# Vivado block design block_design, Vivado 2015.3
# (continued, part 2 of 3)
current_bd_instance /hier_ps
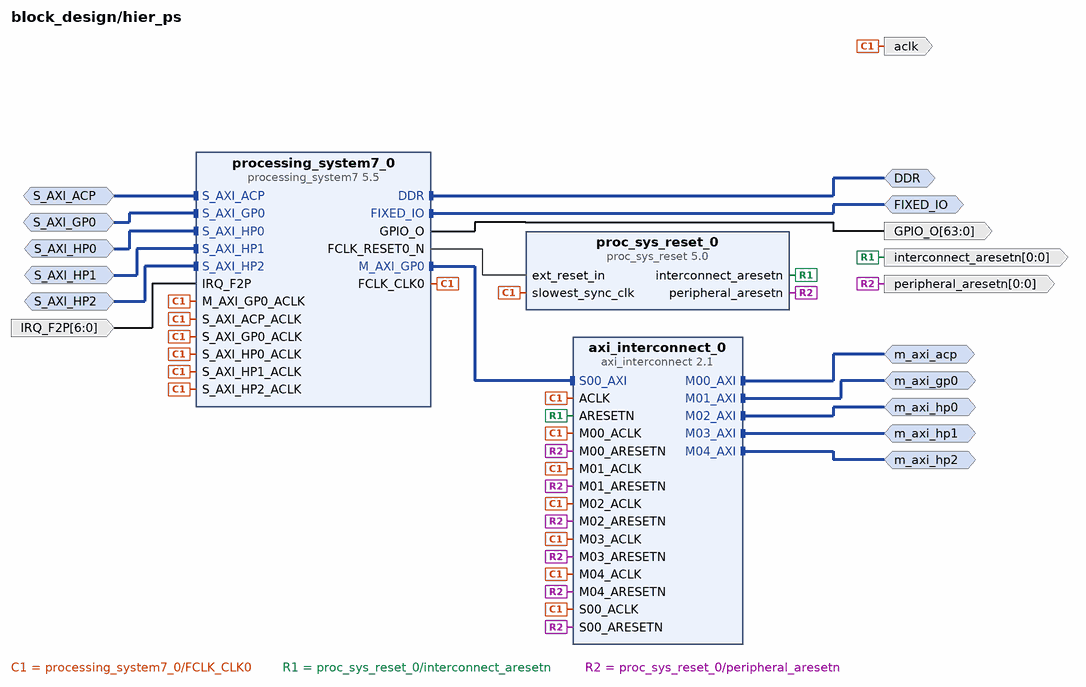
[diagram p24: block diagram inside /hier_ps]
create_bd_intf_pin -mode Master -vlnv xilinx.com:interface:ddrx_rtl:1.0 DDR
create_bd_intf_pin -mode Master -vlnv xilinx.com:display_processing_system7:fixedio_rtl:1.0 FIXED_IO
create_bd_intf_pin -mode Slave -vlnv xilinx.com:interface:aximm_rtl:1.0 S_AXI_ACP
create_bd_intf_pin -mode Slave -vlnv xilinx.com:interface:aximm_rtl:1.0 S_AXI_GP0
create_bd_intf_pin -mode Slave -vlnv xilinx.com:interface:aximm_rtl:1.0 S_AXI_HP0
create_bd_intf_pin -mode Slave -vlnv xilinx.com:interface:aximm_rtl:1.0 S_AXI_HP1
create_bd_intf_pin -mode Slave -vlnv xilinx.com:interface:aximm_rtl:1.0 S_AXI_HP2
create_bd_intf_pin -mode Master -vlnv xilinx.com:interface:aximm_rtl:1.0 m_axi_acp
create_bd_intf_pin -mode Master -vlnv xilinx.com:interface:aximm_rtl:1.0 m_axi_gp0
create_bd_intf_pin -mode Master -vlnv xilinx.com:interface:aximm_rtl:1.0 m_axi_hp0
create_bd_intf_pin -mode Master -vlnv xilinx.com:interface:aximm_rtl:1.0 m_axi_hp1
create_bd_intf_pin -mode Master -vlnv xilinx.com:interface:aximm_rtl:1.0 m_axi_hp2
create_bd_pin -dir O -from 63 -to 0 GPIO_O
create_bd_pin -dir I -from 6 -to 0 -type intr IRQ_F2P
create_bd_pin -dir O aclk
create_bd_pin -dir O -from 0 -to 0 peripheral_aresetn
create_bd_pin -dir O -from 0 -to 0 interconnect_aresetn

create_bd_cell -type ip -vlnv xilinx.com:ip:axi_interconnect:2.1 axi_interconnect_0
set_property -dict {CONFIG.NUM_MI 5 CONFIG.STRATEGY 2} [get_bd_cells axi_interconnect_0]
create_bd_cell -type ip -vlnv xilinx.com:ip:proc_sys_reset:5.0 proc_sys_reset_0
create_bd_cell -type ip -vlnv xilinx.com:ip:processing_system7:5.5 processing_system7_0
set_property -dict [list \
  CONFIG.PCW_USE_S_AXI_GP0 1 \
  CONFIG.PCW_USE_S_AXI_ACP 1 \
  CONFIG.PCW_USE_S_AXI_HP0 1 \
  CONFIG.PCW_USE_S_AXI_HP1 1 \
  CONFIG.PCW_USE_S_AXI_HP2 1 \
  CONFIG.PCW_USE_FABRIC_INTERRUPT 1 \
  CONFIG.PCW_USE_HIGH_OCM 1 \
  CONFIG.PCW_S_AXI_HP0_DATA_WIDTH 32 \
  CONFIG.PCW_IRQ_F2P_INTR 1 \
  CONFIG.PCW_ENET0_PERIPHERAL_ENABLE 0 \
  CONFIG.PCW_TTC0_PERIPHERAL_ENABLE 1 \
  CONFIG.PCW_TTC0_TTC0_IO {MIO 18 .. 19} \
  CONFIG.PCW_USB0_PERIPHERAL_ENABLE 0 \
  CONFIG.PCW_GPIO_MIO_GPIO_ENABLE 0 \
  CONFIG.PCW_GPIO_EMIO_GPIO_ENABLE 1 \
  CONFIG.preset ZedBoard \
] [get_bd_cells processing_system7_0]
# 2 more settings of processing_system7_0 are not shown: defaults, MIO pin electricals, DDR timing, and values the tool derives

# ---- connections ----

current_bd_instance /hier_pspl_port_acp
connect_bd_intf_net [get_bd_intf_pins axi_interconnect_0/M00_AXI] [get_bd_intf_pins hier_hardware_accelerator_0/s_axi]
connect_bd_intf_net [get_bd_intf_pins axi_interconnect_1/S00_AXI] [get_bd_intf_pins hier_hardware_accelerator_0/m_axi]
connect_bd_intf_net [get_bd_intf_pins hier_hardware_accelerator_1/m_axi] [get_bd_intf_pins axi_interconnect_1/S01_AXI]
connect_bd_intf_net [get_bd_intf_pins axi_interconnect_0/M01_AXI] [get_bd_intf_pins hier_hardware_accelerator_1/s_axi]
connect_bd_intf_net [get_bd_intf_pins m_axi] [get_bd_intf_pins axi_interconnect_1/M00_AXI]
connect_bd_intf_net [get_bd_intf_pins s_axi] [get_bd_intf_pins axi_interconnect_0/S00_AXI]
connect_bd_net [get_bd_pins aclk] \
  [get_bd_pins hier_hardware_accelerator_0/aclk] [get_bd_pins hier_hardware_accelerator_1/aclk] \
  [get_bd_pins axi_interconnect_0/ACLK] [get_bd_pins axi_interconnect_0/S00_ACLK] [get_bd_pins axi_interconnect_0/M00_ACLK] \
  [get_bd_pins axi_interconnect_0/M01_ACLK] [get_bd_pins axi_interconnect_1/ACLK] [get_bd_pins axi_interconnect_1/S00_ACLK] \
  [get_bd_pins axi_interconnect_1/M00_ACLK] [get_bd_pins axi_interconnect_1/S01_ACLK]
connect_bd_net [get_bd_pins global_enable] \
  [get_bd_pins hier_hardware_accelerator_0/global_enable] [get_bd_pins hier_hardware_accelerator_1/global_enable]
connect_bd_net [get_bd_pins peripheral_aresetn] \
  [get_bd_pins hier_hardware_accelerator_0/peripheral_aresetn] [get_bd_pins hier_hardware_accelerator_1/peripheral_aresetn] \
  [get_bd_pins axi_interconnect_0/S00_ARESETN] [get_bd_pins axi_interconnect_0/M00_ARESETN] \
  [get_bd_pins axi_interconnect_0/M01_ARESETN] [get_bd_pins axi_interconnect_1/S00_ARESETN] \
  [get_bd_pins axi_interconnect_1/M00_ARESETN] [get_bd_pins axi_interconnect_1/S01_ARESETN]
connect_bd_net [get_bd_pins interconnect_aresetn] \
  [get_bd_pins hier_hardware_accelerator_0/interconnect_aresetn] \
  [get_bd_pins hier_hardware_accelerator_1/interconnect_aresetn] [get_bd_pins axi_interconnect_0/ARESETN] \
  [get_bd_pins axi_interconnect_1/ARESETN]
connect_bd_net [get_bd_pins hier_hardware_accelerator_0/ready] [get_bd_pins xlconcat_ready/In0]
connect_bd_net [get_bd_pins hier_hardware_accelerator_1/ready] [get_bd_pins xlconcat_ready/In1]
connect_bd_net [get_bd_pins xlconcat_ready/dout] [get_bd_pins ready]
connect_bd_net [get_bd_pins local_enable] [get_bd_pins xlslice_local_enable_0/Din] [get_bd_pins xlslice_local_enable_1/Din]
connect_bd_net [get_bd_pins xlslice_local_enable_0/Dout] [get_bd_pins hier_hardware_accelerator_0/local_enable]
connect_bd_net [get_bd_pins xlslice_local_enable_1/Dout] [get_bd_pins hier_hardware_accelerator_1/local_enable]

current_bd_instance /hier_pspl_port_acp/hier_hardware_accelerator_0
connect_bd_intf_net [get_bd_intf_pins axi_interconnect_0/M00_AXI] [get_bd_intf_pins hardware_accelerator_0/s_axi_lite_registers]
connect_bd_intf_net [get_bd_intf_pins axi_interconnect_0/M01_AXI] [get_bd_intf_pins axi3_metrics_counter_0/s_axi_lite]
connect_bd_intf_net [get_bd_intf_pins axi_interconnect_1/S00_AXI] [get_bd_intf_pins hardware_accelerator_0/m_axi_full_data]
connect_bd_intf_net [get_bd_intf_pins axi_interconnect_1/S00_AXI] [get_bd_intf_pins axi3_metrics_counter_0/axi3_monitor]
connect_bd_intf_net [get_bd_intf_pins s_axi] [get_bd_intf_pins axi_interconnect_0/S00_AXI]
connect_bd_intf_net [get_bd_intf_pins m_axi] [get_bd_intf_pins axi_interconnect_1/M00_AXI]
connect_bd_net [get_bd_pins local_enable] [get_bd_pins hier_enable_logic/local_enable]
connect_bd_net [get_bd_pins global_enable] [get_bd_pins hier_enable_logic/global_enable]
connect_bd_net -net hier_enable_logic_enable [get_bd_pins hier_enable_logic/actual_enable] \
  [get_bd_pins axi3_metrics_counter_0/counter_start] [get_bd_pins hardware_accelerator_0/enable]
connect_bd_net [get_bd_pins hardware_accelerator_0/ready] [get_bd_pins ready] [get_bd_pins axi3_metrics_counter_0/counter_finish]
connect_bd_net [get_bd_pins aclk] \
  [get_bd_pins axi3_metrics_counter_0/aclk] [get_bd_pins axi_interconnect_0/ACLK] [get_bd_pins axi_interconnect_0/S00_ACLK] \
  [get_bd_pins axi_interconnect_0/M00_ACLK] [get_bd_pins axi_interconnect_0/M01_ACLK] [get_bd_pins axi_interconnect_1/ACLK] \
  [get_bd_pins axi_interconnect_1/S00_ACLK] [get_bd_pins axi_interconnect_1/M00_ACLK] \
  [get_bd_pins hardware_accelerator_0/s_axi_aclk]
connect_bd_net -net interconnectl_aresetn_1 [get_bd_pins interconnect_aresetn] \
  [get_bd_pins axi_interconnect_0/ARESETN] [get_bd_pins axi_interconnect_1/ARESETN]
connect_bd_net [get_bd_pins peripheral_aresetn] \
  [get_bd_pins axi3_metrics_counter_0/aresetn] [get_bd_pins axi_interconnect_0/S00_ARESETN] \
  [get_bd_pins axi_interconnect_0/M00_ARESETN] [get_bd_pins axi_interconnect_0/M01_ARESETN] \
  [get_bd_pins axi_interconnect_1/S00_ARESETN] [get_bd_pins axi_interconnect_1/M00_ARESETN] \
  [get_bd_pins hardware_accelerator_0/s_axi_aresetn]

current_bd_instance /hier_pspl_port_acp/hier_hardware_accelerator_0/hier_enable_logic
connect_bd_net -net local_1 [get_bd_pins local_enable] [get_bd_pins xlconcat_0/In0]
connect_bd_net -net global_1 [get_bd_pins global_enable] [get_bd_pins xlconcat_0/In1]
connect_bd_net [get_bd_pins xlconcat_0/dout] [get_bd_pins util_reduced_logic_and_0/Op1]
connect_bd_net [get_bd_pins util_reduced_logic_and_0/Res] [get_bd_pins actual_enable]

current_bd_instance /hier_pspl_port_acp/hier_hardware_accelerator_1
connect_bd_intf_net [get_bd_intf_pins axi_interconnect_0/M00_AXI] [get_bd_intf_pins hardware_accelerator_0/s_axi_lite_registers]
connect_bd_intf_net [get_bd_intf_pins axi_interconnect_0/M01_AXI] [get_bd_intf_pins axi3_metrics_counter_0/s_axi_lite]
connect_bd_intf_net [get_bd_intf_pins axi_interconnect_1/S00_AXI] [get_bd_intf_pins hardware_accelerator_0/m_axi_full_data]
connect_bd_intf_net [get_bd_intf_pins axi_interconnect_1/S00_AXI] [get_bd_intf_pins axi3_metrics_counter_0/axi3_monitor]
connect_bd_intf_net [get_bd_intf_pins s_axi] [get_bd_intf_pins axi_interconnect_0/S00_AXI]
connect_bd_intf_net [get_bd_intf_pins m_axi] [get_bd_intf_pins axi_interconnect_1/M00_AXI]
connect_bd_net [get_bd_pins local_enable] [get_bd_pins hier_enable_logic/local_enable]
connect_bd_net [get_bd_pins global_enable] [get_bd_pins hier_enable_logic/global_enable]
connect_bd_net -net hier_enable_logic_enable [get_bd_pins hier_enable_logic/actual_enable] \
  [get_bd_pins axi3_metrics_counter_0/counter_start] [get_bd_pins hardware_accelerator_0/enable]
connect_bd_net [get_bd_pins hardware_accelerator_0/ready] [get_bd_pins ready] [get_bd_pins axi3_metrics_counter_0/counter_finish]
connect_bd_net [get_bd_pins aclk] \
  [get_bd_pins axi3_metrics_counter_0/aclk] [get_bd_pins axi_interconnect_0/ACLK] [get_bd_pins axi_interconnect_0/S00_ACLK] \
  [get_bd_pins axi_interconnect_0/M00_ACLK] [get_bd_pins axi_interconnect_0/M01_ACLK] [get_bd_pins axi_interconnect_1/ACLK] \
  [get_bd_pins axi_interconnect_1/S00_ACLK] [get_bd_pins axi_interconnect_1/M00_ACLK] \
  [get_bd_pins hardware_accelerator_0/s_axi_aclk]
connect_bd_net -net interconnectl_aresetn_1 [get_bd_pins interconnect_aresetn] \
  [get_bd_pins axi_interconnect_0/ARESETN] [get_bd_pins axi_interconnect_1/ARESETN]
connect_bd_net [get_bd_pins peripheral_aresetn] \
  [get_bd_pins axi3_metrics_counter_0/aresetn] [get_bd_pins axi_interconnect_0/S00_ARESETN] \
  [get_bd_pins axi_interconnect_0/M00_ARESETN] [get_bd_pins axi_interconnect_0/M01_ARESETN] \
  [get_bd_pins axi_interconnect_1/S00_ARESETN] [get_bd_pins axi_interconnect_1/M00_ARESETN] \
  [get_bd_pins hardware_accelerator_0/s_axi_aresetn]

current_bd_instance /hier_pspl_port_acp/hier_hardware_accelerator_1/hier_enable_logic
connect_bd_net -net local_1 [get_bd_pins local_enable] [get_bd_pins xlconcat_0/In0]
connect_bd_net -net global_1 [get_bd_pins global_enable] [get_bd_pins xlconcat_0/In1]
connect_bd_net [get_bd_pins xlconcat_0/dout] [get_bd_pins util_reduced_logic_and_0/Op1]
connect_bd_net [get_bd_pins util_reduced_logic_and_0/Res] [get_bd_pins actual_enable]

current_bd_instance /hier_pspl_port_hp0
connect_bd_intf_net [get_bd_intf_pins axi_interconnect_0/M00_AXI] [get_bd_intf_pins hier_hardware_accelerator_0/s_axi]
connect_bd_intf_net [get_bd_intf_pins axi_interconnect_1/S00_AXI] [get_bd_intf_pins hier_hardware_accelerator_0/m_axi]
connect_bd_intf_net [get_bd_intf_pins m_axi] [get_bd_intf_pins axi_interconnect_1/M00_AXI]
connect_bd_intf_net [get_bd_intf_pins s_axi] [get_bd_intf_pins axi_interconnect_0/S00_AXI]
connect_bd_net [get_bd_pins aclk] \
  [get_bd_pins hier_hardware_accelerator_0/aclk] [get_bd_pins axi_interconnect_0/ACLK] \
  [get_bd_pins axi_interconnect_0/S00_ACLK] [get_bd_pins axi_interconnect_0/M00_ACLK] [get_bd_pins axi_interconnect_1/ACLK] \
  [get_bd_pins axi_interconnect_1/S00_ACLK] [get_bd_pins axi_interconnect_1/M00_ACLK]
connect_bd_net [get_bd_pins global_enable] [get_bd_pins hier_hardware_accelerator_0/global_enable]
connect_bd_net [get_bd_pins local_enable] [get_bd_pins hier_hardware_accelerator_0/local_enable]
connect_bd_net [get_bd_pins peripheral_aresetn] \
  [get_bd_pins hier_hardware_accelerator_0/peripheral_aresetn] [get_bd_pins axi_interconnect_0/S00_ARESETN] \
  [get_bd_pins axi_interconnect_0/M00_ARESETN] [get_bd_pins axi_interconnect_1/S00_ARESETN] \
  [get_bd_pins axi_interconnect_1/M00_ARESETN]
connect_bd_net [get_bd_pins interconnect_aresetn] \
  [get_bd_pins hier_hardware_accelerator_0/interconnect_aresetn] [get_bd_pins axi_interconnect_0/ARESETN] \
  [get_bd_pins axi_interconnect_1/ARESETN]
connect_bd_net [get_bd_pins hier_hardware_accelerator_0/ready] [get_bd_pins ready]

current_bd_instance /hier_pspl_port_hp0/hier_hardware_accelerator_0
connect_bd_intf_net [get_bd_intf_pins axi_interconnect_0/M00_AXI] [get_bd_intf_pins hardware_accelerator_0/s_axi_lite_registers]
connect_bd_intf_net [get_bd_intf_pins axi_interconnect_0/M01_AXI] [get_bd_intf_pins axi3_metrics_counter_0/s_axi_lite]
connect_bd_intf_net [get_bd_intf_pins axi_interconnect_1/S00_AXI] [get_bd_intf_pins hardware_accelerator_0/m_axi_full_data]
connect_bd_intf_net [get_bd_intf_pins axi_interconnect_1/S00_AXI] [get_bd_intf_pins axi3_metrics_counter_0/axi3_monitor]
connect_bd_intf_net [get_bd_intf_pins s_axi] [get_bd_intf_pins axi_interconnect_0/S00_AXI]
connect_bd_intf_net [get_bd_intf_pins m_axi] [get_bd_intf_pins axi_interconnect_1/M00_AXI]
connect_bd_net [get_bd_pins local_enable] [get_bd_pins hier_enable_logic/local_enable]
connect_bd_net [get_bd_pins global_enable] [get_bd_pins hier_enable_logic/global_enable]
connect_bd_net -net hier_enable_logic_enable [get_bd_pins hier_enable_logic/actual_enable] \
  [get_bd_pins axi3_metrics_counter_0/counter_start] [get_bd_pins hardware_accelerator_0/enable]
connect_bd_net [get_bd_pins hardware_accelerator_0/ready] [get_bd_pins ready] [get_bd_pins axi3_metrics_counter_0/counter_finish]
connect_bd_net [get_bd_pins aclk] \
  [get_bd_pins axi3_metrics_counter_0/aclk] [get_bd_pins axi_interconnect_0/ACLK] [get_bd_pins axi_interconnect_0/S00_ACLK] \
  [get_bd_pins axi_interconnect_0/M00_ACLK] [get_bd_pins axi_interconnect_0/M01_ACLK] [get_bd_pins axi_interconnect_1/ACLK] \
  [get_bd_pins axi_interconnect_1/S00_ACLK] [get_bd_pins axi_interconnect_1/M00_ACLK] \
  [get_bd_pins hardware_accelerator_0/s_axi_aclk]
connect_bd_net -net interconnectl_aresetn_1 [get_bd_pins interconnect_aresetn] \
  [get_bd_pins axi_interconnect_0/ARESETN] [get_bd_pins axi_interconnect_1/ARESETN]
connect_bd_net [get_bd_pins peripheral_aresetn] \
  [get_bd_pins axi3_metrics_counter_0/aresetn] [get_bd_pins axi_interconnect_0/S00_ARESETN] \
  [get_bd_pins axi_interconnect_0/M00_ARESETN] [get_bd_pins axi_interconnect_0/M01_ARESETN] \
  [get_bd_pins axi_interconnect_1/S00_ARESETN] [get_bd_pins axi_interconnect_1/M00_ARESETN] \
  [get_bd_pins hardware_accelerator_0/s_axi_aresetn]

current_bd_instance /hier_pspl_port_hp0/hier_hardware_accelerator_0/hier_enable_logic
connect_bd_net -net local_1 [get_bd_pins local_enable] [get_bd_pins xlconcat_0/In0]
connect_bd_net -net global_1 [get_bd_pins global_enable] [get_bd_pins xlconcat_0/In1]
connect_bd_net [get_bd_pins xlconcat_0/dout] [get_bd_pins util_reduced_logic_and_0/Op1]
connect_bd_net [get_bd_pins util_reduced_logic_and_0/Res] [get_bd_pins actual_enable]

current_bd_instance /hier_pspl_port_gp0
connect_bd_intf_net [get_bd_intf_pins axi_interconnect_0/M00_AXI] [get_bd_intf_pins hier_hardware_accelerator_0/s_axi]
connect_bd_intf_net [get_bd_intf_pins axi_interconnect_1/S00_AXI] [get_bd_intf_pins hier_hardware_accelerator_0/m_axi]
connect_bd_intf_net [get_bd_intf_pins m_axi] [get_bd_intf_pins axi_interconnect_1/M00_AXI]
connect_bd_intf_net [get_bd_intf_pins s_axi] [get_bd_intf_pins axi_interconnect_0/S00_AXI]
connect_bd_net [get_bd_pins aclk] \
  [get_bd_pins hier_hardware_accelerator_0/aclk] [get_bd_pins axi_interconnect_0/ACLK] \
  [get_bd_pins axi_interconnect_0/S00_ACLK] [get_bd_pins axi_interconnect_0/M00_ACLK] [get_bd_pins axi_interconnect_1/ACLK] \
  [get_bd_pins axi_interconnect_1/S00_ACLK] [get_bd_pins axi_interconnect_1/M00_ACLK]
connect_bd_net [get_bd_pins global_enable] [get_bd_pins hier_hardware_accelerator_0/global_enable]
connect_bd_net [get_bd_pins local_enable] [get_bd_pins hier_hardware_accelerator_0/local_enable]
connect_bd_net [get_bd_pins peripheral_aresetn] \
  [get_bd_pins hier_hardware_accelerator_0/peripheral_aresetn] [get_bd_pins axi_interconnect_0/S00_ARESETN] \
  [get_bd_pins axi_interconnect_0/M00_ARESETN] [get_bd_pins axi_interconnect_1/S00_ARESETN] \
  [get_bd_pins axi_interconnect_1/M00_ARESETN]
connect_bd_net [get_bd_pins interconnect_aresetn] \
  [get_bd_pins hier_hardware_accelerator_0/interconnect_aresetn] [get_bd_pins axi_interconnect_0/ARESETN] \
  [get_bd_pins axi_interconnect_1/ARESETN]
connect_bd_net [get_bd_pins hier_hardware_accelerator_0/ready] [get_bd_pins ready]

current_bd_instance /hier_pspl_port_gp0/hier_hardware_accelerator_0
connect_bd_intf_net [get_bd_intf_pins axi_interconnect_0/M00_AXI] [get_bd_intf_pins hardware_accelerator_0/s_axi_lite_registers]
connect_bd_intf_net [get_bd_intf_pins axi_interconnect_0/M01_AXI] [get_bd_intf_pins axi3_metrics_counter_0/s_axi_lite]
connect_bd_intf_net [get_bd_intf_pins axi_interconnect_1/S00_AXI] [get_bd_intf_pins hardware_accelerator_0/m_axi_full_data]
connect_bd_intf_net [get_bd_intf_pins axi_interconnect_1/S00_AXI] [get_bd_intf_pins axi3_metrics_counter_0/axi3_monitor]
connect_bd_intf_net [get_bd_intf_pins s_axi] [get_bd_intf_pins axi_interconnect_0/S00_AXI]
connect_bd_intf_net [get_bd_intf_pins m_axi] [get_bd_intf_pins axi_interconnect_1/M00_AXI]
connect_bd_net [get_bd_pins local_enable] [get_bd_pins hier_enable_logic/local_enable]
connect_bd_net [get_bd_pins global_enable] [get_bd_pins hier_enable_logic/global_enable]
connect_bd_net -net hier_enable_logic_enable [get_bd_pins hier_enable_logic/actual_enable] \
  [get_bd_pins axi3_metrics_counter_0/counter_start] [get_bd_pins hardware_accelerator_0/enable]
connect_bd_net [get_bd_pins hardware_accelerator_0/ready] [get_bd_pins ready] [get_bd_pins axi3_metrics_counter_0/counter_finish]
connect_bd_net [get_bd_pins aclk] \
  [get_bd_pins axi3_metrics_counter_0/aclk] [get_bd_pins axi_interconnect_0/ACLK] [get_bd_pins axi_interconnect_0/S00_ACLK] \
  [get_bd_pins axi_interconnect_0/M00_ACLK] [get_bd_pins axi_interconnect_0/M01_ACLK] [get_bd_pins axi_interconnect_1/ACLK] \
  [get_bd_pins axi_interconnect_1/S00_ACLK] [get_bd_pins axi_interconnect_1/M00_ACLK] \
  [get_bd_pins hardware_accelerator_0/s_axi_aclk]
connect_bd_net -net interconnectl_aresetn_1 [get_bd_pins interconnect_aresetn] \
  [get_bd_pins axi_interconnect_0/ARESETN] [get_bd_pins axi_interconnect_1/ARESETN]
connect_bd_net [get_bd_pins peripheral_aresetn] \
  [get_bd_pins axi3_metrics_counter_0/aresetn] [get_bd_pins axi_interconnect_0/S00_ARESETN] \
  [get_bd_pins axi_interconnect_0/M00_ARESETN] [get_bd_pins axi_interconnect_0/M01_ARESETN] \
  [get_bd_pins axi_interconnect_1/S00_ARESETN] [get_bd_pins axi_interconnect_1/M00_ARESETN] \
  [get_bd_pins hardware_accelerator_0/s_axi_aresetn]

current_bd_instance /hier_pspl_port_gp0/hier_hardware_accelerator_0/hier_enable_logic
connect_bd_net -net local_1 [get_bd_pins local_enable] [get_bd_pins xlconcat_0/In0]
connect_bd_net -net global_1 [get_bd_pins global_enable] [get_bd_pins xlconcat_0/In1]
connect_bd_net [get_bd_pins xlconcat_0/dout] [get_bd_pins util_reduced_logic_and_0/Op1]
connect_bd_net [get_bd_pins util_reduced_logic_and_0/Res] [get_bd_pins actual_enable]

current_bd_instance /hier_pspl_port_hp1
connect_bd_intf_net [get_bd_intf_pins axi_interconnect_0/M00_AXI] [get_bd_intf_pins hier_hardware_accelerator_0/s_axi]
connect_bd_intf_net [get_bd_intf_pins axi_interconnect_1/S00_AXI] [get_bd_intf_pins hier_hardware_accelerator_0/m_axi]
connect_bd_intf_net [get_bd_intf_pins m_axi] [get_bd_intf_pins axi_interconnect_1/M00_AXI]
connect_bd_intf_net [get_bd_intf_pins s_axi] [get_bd_intf_pins axi_interconnect_0/S00_AXI]
connect_bd_net [get_bd_pins aclk] \
  [get_bd_pins hier_hardware_accelerator_0/aclk] [get_bd_pins axi_interconnect_0/ACLK] \
  [get_bd_pins axi_interconnect_0/S00_ACLK] [get_bd_pins axi_interconnect_0/M00_ACLK] [get_bd_pins axi_interconnect_1/ACLK] \
  [get_bd_pins axi_interconnect_1/S00_ACLK] [get_bd_pins axi_interconnect_1/M00_ACLK]
connect_bd_net [get_bd_pins global_enable] [get_bd_pins hier_hardware_accelerator_0/global_enable]
connect_bd_net [get_bd_pins local_enable] [get_bd_pins hier_hardware_accelerator_0/local_enable]
connect_bd_net [get_bd_pins peripheral_aresetn] \
  [get_bd_pins hier_hardware_accelerator_0/peripheral_aresetn] [get_bd_pins axi_interconnect_0/S00_ARESETN] \
  [get_bd_pins axi_interconnect_0/M00_ARESETN] [get_bd_pins axi_interconnect_1/S00_ARESETN] \
  [get_bd_pins axi_interconnect_1/M00_ARESETN]
connect_bd_net [get_bd_pins interconnect_aresetn] \
  [get_bd_pins hier_hardware_accelerator_0/interconnect_aresetn] [get_bd_pins axi_interconnect_0/ARESETN] \
  [get_bd_pins axi_interconnect_1/ARESETN]
connect_bd_net [get_bd_pins hier_hardware_accelerator_0/ready] [get_bd_pins ready]

current_bd_instance /hier_pspl_port_hp1/hier_hardware_accelerator_0
connect_bd_intf_net [get_bd_intf_pins axi_interconnect_0/M00_AXI] [get_bd_intf_pins hardware_accelerator_0/s_axi_lite_registers]
connect_bd_intf_net [get_bd_intf_pins axi_interconnect_0/M01_AXI] [get_bd_intf_pins axi3_metrics_counter_0/s_axi_lite]
connect_bd_intf_net [get_bd_intf_pins axi_interconnect_1/S00_AXI] [get_bd_intf_pins hardware_accelerator_0/m_axi_full_data]
connect_bd_intf_net [get_bd_intf_pins axi_interconnect_1/S00_AXI] [get_bd_intf_pins axi3_metrics_counter_0/axi3_monitor]
connect_bd_intf_net [get_bd_intf_pins s_axi] [get_bd_intf_pins axi_interconnect_0/S00_AXI]
connect_bd_intf_net [get_bd_intf_pins m_axi] [get_bd_intf_pins axi_interconnect_1/M00_AXI]
connect_bd_net [get_bd_pins local_enable] [get_bd_pins hier_enable_logic/local_enable]
connect_bd_net [get_bd_pins global_enable] [get_bd_pins hier_enable_logic/global_enable]
connect_bd_net -net hier_enable_logic_enable [get_bd_pins hier_enable_logic/actual_enable] \
  [get_bd_pins axi3_metrics_counter_0/counter_start] [get_bd_pins hardware_accelerator_0/enable]
connect_bd_net [get_bd_pins hardware_accelerator_0/ready] [get_bd_pins ready] [get_bd_pins axi3_metrics_counter_0/counter_finish]
connect_bd_net [get_bd_pins aclk] \
  [get_bd_pins axi3_metrics_counter_0/aclk] [get_bd_pins axi_interconnect_0/ACLK] [get_bd_pins axi_interconnect_0/S00_ACLK] \
  [get_bd_pins axi_interconnect_0/M00_ACLK] [get_bd_pins axi_interconnect_0/M01_ACLK] [get_bd_pins axi_interconnect_1/ACLK] \
  [get_bd_pins axi_interconnect_1/S00_ACLK] [get_bd_pins axi_interconnect_1/M00_ACLK] \
  [get_bd_pins hardware_accelerator_0/s_axi_aclk]
connect_bd_net -net interconnectl_aresetn_1 [get_bd_pins interconnect_aresetn] \
  [get_bd_pins axi_interconnect_0/ARESETN] [get_bd_pins axi_interconnect_1/ARESETN]
connect_bd_net [get_bd_pins peripheral_aresetn] \
  [get_bd_pins axi3_metrics_counter_0/aresetn] [get_bd_pins axi_interconnect_0/S00_ARESETN] \
  [get_bd_pins axi_interconnect_0/M00_ARESETN] [get_bd_pins axi_interconnect_0/M01_ARESETN] \
  [get_bd_pins axi_interconnect_1/S00_ARESETN] [get_bd_pins axi_interconnect_1/M00_ARESETN] \
  [get_bd_pins hardware_accelerator_0/s_axi_aresetn]

current_bd_instance /hier_pspl_port_hp1/hier_hardware_accelerator_0/hier_enable_logic
connect_bd_net -net local_1 [get_bd_pins local_enable] [get_bd_pins xlconcat_0/In0]
connect_bd_net -net global_1 [get_bd_pins global_enable] [get_bd_pins xlconcat_0/In1]
connect_bd_net [get_bd_pins xlconcat_0/dout] [get_bd_pins util_reduced_logic_and_0/Op1]
connect_bd_net [get_bd_pins util_reduced_logic_and_0/Res] [get_bd_pins actual_enable]

current_bd_instance /hier_pspl_port_hp2
connect_bd_intf_net [get_bd_intf_pins axi_interconnect_0/M00_AXI] [get_bd_intf_pins hier_hardware_accelerator_0/s_axi]
connect_bd_intf_net [get_bd_intf_pins axi_interconnect_1/S00_AXI] [get_bd_intf_pins hier_hardware_accelerator_0/m_axi]
connect_bd_intf_net [get_bd_intf_pins m_axi] [get_bd_intf_pins axi_interconnect_1/M00_AXI]
connect_bd_intf_net [get_bd_intf_pins s_axi] [get_bd_intf_pins axi_interconnect_0/S00_AXI]
connect_bd_net [get_bd_pins aclk] \
  [get_bd_pins hier_hardware_accelerator_0/aclk] [get_bd_pins axi_interconnect_0/ACLK] \
  [get_bd_pins axi_interconnect_0/S00_ACLK] [get_bd_pins axi_interconnect_0/M00_ACLK] [get_bd_pins axi_interconnect_1/ACLK] \
  [get_bd_pins axi_interconnect_1/S00_ACLK] [get_bd_pins axi_interconnect_1/M00_ACLK]
connect_bd_net [get_bd_pins global_enable] [get_bd_pins hier_hardware_accelerator_0/global_enable]
connect_bd_net [get_bd_pins local_enable] [get_bd_pins hier_hardware_accelerator_0/local_enable]
connect_bd_net [get_bd_pins peripheral_aresetn] \
  [get_bd_pins hier_hardware_accelerator_0/peripheral_aresetn] [get_bd_pins axi_interconnect_0/S00_ARESETN] \
  [get_bd_pins axi_interconnect_0/M00_ARESETN] [get_bd_pins axi_interconnect_1/S00_ARESETN] \
  [get_bd_pins axi_interconnect_1/M00_ARESETN]
connect_bd_net [get_bd_pins interconnect_aresetn] \
  [get_bd_pins hier_hardware_accelerator_0/interconnect_aresetn] [get_bd_pins axi_interconnect_0/ARESETN] \
  [get_bd_pins axi_interconnect_1/ARESETN]
connect_bd_net [get_bd_pins hier_hardware_accelerator_0/ready] [get_bd_pins ready]

current_bd_instance /hier_pspl_port_hp2/hier_hardware_accelerator_0
connect_bd_intf_net [get_bd_intf_pins axi_interconnect_0/M00_AXI] [get_bd_intf_pins hardware_accelerator_0/s_axi_lite_registers]
connect_bd_intf_net [get_bd_intf_pins axi_interconnect_0/M01_AXI] [get_bd_intf_pins axi3_metrics_counter_0/s_axi_lite]
connect_bd_intf_net [get_bd_intf_pins axi_interconnect_1/S00_AXI] [get_bd_intf_pins hardware_accelerator_0/m_axi_full_data]
connect_bd_intf_net [get_bd_intf_pins axi_interconnect_1/S00_AXI] [get_bd_intf_pins axi3_metrics_counter_0/axi3_monitor]
connect_bd_intf_net [get_bd_intf_pins s_axi] [get_bd_intf_pins axi_interconnect_0/S00_AXI]
connect_bd_intf_net [get_bd_intf_pins m_axi] [get_bd_intf_pins axi_interconnect_1/M00_AXI]
connect_bd_net [get_bd_pins local_enable] [get_bd_pins hier_enable_logic/local_enable]
connect_bd_net [get_bd_pins global_enable] [get_bd_pins hier_enable_logic/global_enable]
connect_bd_net -net hier_enable_logic_enable [get_bd_pins hier_enable_logic/actual_enable] \
  [get_bd_pins axi3_metrics_counter_0/counter_start] [get_bd_pins hardware_accelerator_0/enable]
connect_bd_net [get_bd_pins hardware_accelerator_0/ready] [get_bd_pins ready] [get_bd_pins axi3_metrics_counter_0/counter_finish]
connect_bd_net [get_bd_pins aclk] \
  [get_bd_pins axi3_metrics_counter_0/aclk] [get_bd_pins axi_interconnect_0/ACLK] [get_bd_pins axi_interconnect_0/S00_ACLK] \
  [get_bd_pins axi_interconnect_0/M00_ACLK] [get_bd_pins axi_interconnect_0/M01_ACLK] [get_bd_pins axi_interconnect_1/ACLK] \
  [get_bd_pins axi_interconnect_1/S00_ACLK] [get_bd_pins axi_interconnect_1/M00_ACLK] \
  [get_bd_pins hardware_accelerator_0/s_axi_aclk]
connect_bd_net -net interconnectl_aresetn_1 [get_bd_pins interconnect_aresetn] \
  [get_bd_pins axi_interconnect_0/ARESETN] [get_bd_pins axi_interconnect_1/ARESETN]
connect_bd_net [get_bd_pins peripheral_aresetn] \
  [get_bd_pins axi3_metrics_counter_0/aresetn] [get_bd_pins axi_interconnect_0/S00_ARESETN] \
  [get_bd_pins axi_interconnect_0/M00_ARESETN] [get_bd_pins axi_interconnect_0/M01_ARESETN] \
  [get_bd_pins axi_interconnect_1/S00_ARESETN] [get_bd_pins axi_interconnect_1/M00_ARESETN] \
  [get_bd_pins hardware_accelerator_0/s_axi_aresetn]

current_bd_instance /hier_pspl_port_hp2/hier_hardware_accelerator_0/hier_enable_logic
connect_bd_net -net local_1 [get_bd_pins local_enable] [get_bd_pins xlconcat_0/In0]
connect_bd_net -net global_1 [get_bd_pins global_enable] [get_bd_pins xlconcat_0/In1]
connect_bd_net [get_bd_pins xlconcat_0/dout] [get_bd_pins util_reduced_logic_and_0/Op1]
connect_bd_net [get_bd_pins util_reduced_logic_and_0/Res] [get_bd_pins actual_enable]

current_bd_instance /hier_enables
connect_bd_net -net xlslice_0_Dout [get_bd_pins xlslice_global_enable/Dout] [get_bd_pins global_enable]
connect_bd_net [get_bd_pins outputs] [get_bd_pins xlslice_global_enable/Din] [get_bd_pins xlslice_local_enables/Din]
connect_bd_net [get_bd_pins xlslice_local_enables/Dout] \
  [get_bd_pins local_enables] [get_bd_pins xlslice_enable_acp/Din] [get_bd_pins xlslice_enable_gp0/Din] \
  [get_bd_pins xlslice_enable_hp0/Din] [get_bd_pins xlslice_enable_hp1/Din] [get_bd_pins xlslice_enable_hp2/Din]
connect_bd_net -net xlslice_0_Dout1 [get_bd_pins xlslice_enable_acp/Dout] [get_bd_pins local_enable_acp]
connect_bd_net -net xlslice_1_Dout [get_bd_pins xlslice_enable_gp0/Dout] [get_bd_pins local_enable_gp0]
connect_bd_net -net xlslice_2_Dout [get_bd_pins xlslice_enable_hp0/Dout] [get_bd_pins local_enable_hp0]
connect_bd_net -net xlslice_3_Dout [get_bd_pins xlslice_enable_hp1/Dout] [get_bd_pins local_enable_hp1]
connect_bd_net -net xlslice_4_Dout [get_bd_pins xlslice_enable_hp2/Dout] [get_bd_pins local_enable_hp2]

current_bd_instance /hier_readies
connect_bd_net [get_bd_pins local_ready_acp] [get_bd_pins xlconcat_local_readies/In0]
connect_bd_net -net local_ready_gp0_1 [get_bd_pins local_ready_gp0] [get_bd_pins xlconcat_local_readies/In1]
connect_bd_net -net local_ready_hp0_1 [get_bd_pins local_ready_hp0] [get_bd_pins xlconcat_local_readies/In2]
connect_bd_net -net local_ready_hp1_1 [get_bd_pins local_ready_hp1] [get_bd_pins xlconcat_local_readies/In3]
connect_bd_net -net local_ready_hp2_1 [get_bd_pins local_ready_hp2] [get_bd_pins xlconcat_local_readies/In4]
connect_bd_net [get_bd_pins xlconcat_local_readies/dout] [get_bd_pins hier_global_ready/local_readies] [get_bd_pins xlconcat_interrupts/In0]
connect_bd_net [get_bd_pins global_enable] [get_bd_pins hier_global_ready/global_enable]
connect_bd_net [get_bd_pins local_enables] [get_bd_pins hier_global_ready/local_enables]
connect_bd_net [get_bd_pins hier_global_ready/global_ready] [get_bd_pins xlconcat_interrupts/In1]
connect_bd_net -net xlconcat_0_dout [get_bd_pins xlconcat_interrupts/dout] [get_bd_pins interrupts]

current_bd_instance /hier_readies/hier_global_ready
connect_bd_net [get_bd_pins local_enables] [get_bd_pins hier_is_equal_0/Op1] [get_bd_pins hier_is_not_equal_0/Op1]
connect_bd_net [get_bd_pins local_readies] [get_bd_pins hier_is_equal_0/Op2]
connect_bd_net -net xlconstant_0_dout [get_bd_pins xlconstant_0_0/dout] [get_bd_pins hier_is_not_equal_0/Op2]
connect_bd_net [get_bd_pins global_enable] [get_bd_pins xlconcat_0/In0]
connect_bd_net [get_bd_pins hier_is_equal_0/Res] [get_bd_pins xlconcat_0/In1]
connect_bd_net -net util_vector_logic_not_0_Res [get_bd_pins hier_is_not_equal_0/Res] [get_bd_pins xlconcat_0/In2]
connect_bd_net [get_bd_pins xlconcat_0/dout] [get_bd_pins util_reduced_logic_and_0/Op1]
connect_bd_net -net util_reduced_logic_0_Res [get_bd_pins util_reduced_logic_and_0/Res] [get_bd_pins global_ready]

current_bd_instance /hier_readies/hier_global_ready/hier_is_equal_0
connect_bd_net [get_bd_pins util_vector_logic_xor_0/Res] [get_bd_pins util_reduced_logic_or_0/Op1]
connect_bd_net [get_bd_pins util_reduced_logic_or_0/Res] [get_bd_pins util_vector_logic_not_0/Op1]
connect_bd_net -net local_enables_1 [get_bd_pins Op1] [get_bd_pins util_vector_logic_xor_0/Op1]
connect_bd_net -net local_readies_1 [get_bd_pins Op2] [get_bd_pins util_vector_logic_xor_0/Op2]
connect_bd_net [get_bd_pins util_vector_logic_not_0/Res] [get_bd_pins Res]

current_bd_instance /hier_readies/hier_global_ready/hier_is_not_equal_0
connect_bd_net [get_bd_pins hier_is_equal_1/Res] [get_bd_pins util_vector_logic_not_0/Op1]
connect_bd_net [get_bd_pins util_vector_logic_not_0/Res] [get_bd_pins Res]
connect_bd_net -net local_enables_1 [get_bd_pins Op1] [get_bd_pins hier_is_equal_1/Op1]
connect_bd_net -net xlconstant_0_dout [get_bd_pins Op2] [get_bd_pins hier_is_equal_1/Op2]

current_bd_instance /hier_readies/hier_global_ready/hier_is_not_equal_0/hier_is_equal_1
connect_bd_net [get_bd_pins util_vector_logic_xor_0/Res] [get_bd_pins util_reduced_logic_or_0/Op1]
connect_bd_net [get_bd_pins util_reduced_logic_or_0/Res] [get_bd_pins util_vector_logic_not_0/Op1]
connect_bd_net -net local_enables_1 [get_bd_pins Op1] [get_bd_pins util_vector_logic_xor_0/Op1]
connect_bd_net -net local_readies_1 [get_bd_pins Op2] [get_bd_pins util_vector_logic_xor_0/Op2]
connect_bd_net [get_bd_pins util_vector_logic_not_0/Res] [get_bd_pins Res]

current_bd_instance /hier_ps
connect_bd_intf_net [get_bd_intf_pins axi_interconnect_0/S00_AXI] [get_bd_intf_pins processing_system7_0/M_AXI_GP0]
connect_bd_intf_net [get_bd_intf_pins DDR] [get_bd_intf_pins processing_system7_0/DDR]
connect_bd_intf_net [get_bd_intf_pins FIXED_IO] [get_bd_intf_pins processing_system7_0/FIXED_IO]
connect_bd_intf_net -intf_net hier_pspl_port_acp_m_axi [get_bd_intf_pins S_AXI_ACP] [get_bd_intf_pins processing_system7_0/S_AXI_ACP]
connect_bd_intf_net -intf_net hier_pspl_port_gp0_m_axi [get_bd_intf_pins S_AXI_GP0] [get_bd_intf_pins processing_system7_0/S_AXI_GP0]
connect_bd_intf_net -intf_net hier_pspl_port_hp0_m_axi [get_bd_intf_pins S_AXI_HP0] [get_bd_intf_pins processing_system7_0/S_AXI_HP0]
connect_bd_intf_net -intf_net hier_pspl_port_hp1_m_axi [get_bd_intf_pins S_AXI_HP1] [get_bd_intf_pins processing_system7_0/S_AXI_HP1]
connect_bd_intf_net -intf_net hier_pspl_port_hp2_m_axi [get_bd_intf_pins S_AXI_HP2] [get_bd_intf_pins processing_system7_0/S_AXI_HP2]
connect_bd_intf_net [get_bd_intf_pins m_axi_acp] [get_bd_intf_pins axi_interconnect_0/M00_AXI]
connect_bd_intf_net [get_bd_intf_pins m_axi_gp0] [get_bd_intf_pins axi_interconnect_0/M01_AXI]
connect_bd_intf_net [get_bd_intf_pins m_axi_hp0] [get_bd_intf_pins axi_interconnect_0/M02_AXI]
connect_bd_intf_net [get_bd_intf_pins m_axi_hp1] [get_bd_intf_pins axi_interconnect_0/M03_AXI]
connect_bd_intf_net [get_bd_intf_pins m_axi_hp2] [get_bd_intf_pins axi_interconnect_0/M04_AXI]
connect_bd_net [get_bd_pins processing_system7_0/GPIO_O] [get_bd_pins GPIO_O]
connect_bd_net -net hier_readies_interrupts [get_bd_pins IRQ_F2P] [get_bd_pins processing_system7_0/IRQ_F2P]
connect_bd_net [get_bd_pins processing_system7_0/FCLK_RESET0_N] [get_bd_pins proc_sys_reset_0/ext_reset_in]
connect_bd_net [get_bd_pins processing_system7_0/FCLK_CLK0] \
  [get_bd_pins aclk] [get_bd_pins axi_interconnect_0/ACLK] [get_bd_pins axi_interconnect_0/S00_ACLK] \
  [get_bd_pins axi_interconnect_0/M00_ACLK] [get_bd_pins axi_interconnect_0/M01_ACLK] \
  [get_bd_pins axi_interconnect_0/M02_ACLK] [get_bd_pins axi_interconnect_0/M03_ACLK] \
  [get_bd_pins axi_interconnect_0/M04_ACLK] [get_bd_pins proc_sys_reset_0/slowest_sync_clk] \
  [get_bd_pins processing_system7_0/M_AXI_GP0_ACLK] [get_bd_pins processing_system7_0/S_AXI_GP0_ACLK] \
  [get_bd_pins processing_system7_0/S_AXI_ACP_ACLK] [get_bd_pins processing_system7_0/S_AXI_HP0_ACLK] \
  [get_bd_pins processing_system7_0/S_AXI_HP1_ACLK] [get_bd_pins processing_system7_0/S_AXI_HP2_ACLK]
connect_bd_net [get_bd_pins proc_sys_reset_0/interconnect_aresetn] [get_bd_pins interconnect_aresetn] [get_bd_pins axi_interconnect_0/ARESETN]
connect_bd_net [get_bd_pins proc_sys_reset_0/peripheral_aresetn] \
  [get_bd_pins peripheral_aresetn] [get_bd_pins axi_interconnect_0/S00_ARESETN] [get_bd_pins axi_interconnect_0/M00_ARESETN] \
  [get_bd_pins axi_interconnect_0/M01_ARESETN] [get_bd_pins axi_interconnect_0/M02_ARESETN] \
  [get_bd_pins axi_interconnect_0/M03_ARESETN] [get_bd_pins axi_interconnect_0/M04_ARESETN]

current_bd_instance /
connect_bd_intf_net [get_bd_intf_pins hier_pspl_port_acp/m_axi] [get_bd_intf_pins hier_ps/S_AXI_ACP]
connect_bd_intf_net [get_bd_intf_pins hier_pspl_port_gp0/m_axi] [get_bd_intf_pins hier_ps/S_AXI_GP0]
connect_bd_intf_net [get_bd_intf_pins hier_pspl_port_hp0/m_axi] [get_bd_intf_pins hier_ps/S_AXI_HP0]
connect_bd_intf_net [get_bd_intf_pins hier_pspl_port_hp1/m_axi] [get_bd_intf_pins hier_ps/S_AXI_HP1]
connect_bd_intf_net [get_bd_intf_pins hier_pspl_port_hp2/m_axi] [get_bd_intf_pins hier_ps/S_AXI_HP2]
connect_bd_intf_net [get_bd_intf_pins hier_ps/m_axi_acp] [get_bd_intf_pins hier_pspl_port_acp/s_axi]
connect_bd_intf_net [get_bd_intf_pins hier_ps/m_axi_gp0] [get_bd_intf_pins hier_pspl_port_gp0/s_axi]
connect_bd_intf_net [get_bd_intf_pins hier_ps/m_axi_hp0] [get_bd_intf_pins hier_pspl_port_hp0/s_axi]
connect_bd_intf_net [get_bd_intf_pins hier_ps/m_axi_hp1] [get_bd_intf_pins hier_pspl_port_hp2/s_axi]
connect_bd_intf_net [get_bd_intf_pins hier_ps/m_axi_hp2] [get_bd_intf_pins hier_pspl_port_hp1/s_axi]
connect_bd_intf_net -intf_net processing_system7_0_DDR [get_bd_intf_ports DDR] [get_bd_intf_pins hier_ps/DDR]
connect_bd_intf_net -intf_net processing_system7_0_FIXED_IO [get_bd_intf_ports FIXED_IO] [get_bd_intf_pins hier_ps/FIXED_IO]
connect_bd_net -net processing_system7_0_GPIO_O [get_bd_pins hier_ps/GPIO_O] [get_bd_pins hier_enables/outputs]
connect_bd_net [get_bd_pins hier_enables/local_enable_acp] [get_bd_pins hier_pspl_port_acp/local_enable]
connect_bd_net [get_bd_pins hier_enables/local_enable_gp0] [get_bd_pins hier_pspl_port_gp0/local_enable]
connect_bd_net [get_bd_pins hier_enables/local_enable_hp0] [get_bd_pins hier_pspl_port_hp0/local_enable]
connect_bd_net [get_bd_pins hier_enables/local_enable_hp1] [get_bd_pins hier_pspl_port_hp1/local_enable]
connect_bd_net [get_bd_pins hier_enables/local_enables] [get_bd_pins hier_readies/local_enables]
connect_bd_net [get_bd_pins hier_enables/global_enable] \
  [get_bd_pins hier_readies/global_enable] [get_bd_pins hier_pspl_port_acp/global_enable] \
  [get_bd_pins hier_pspl_port_gp0/global_enable] [get_bd_pins hier_pspl_port_hp0/global_enable] \
  [get_bd_pins hier_pspl_port_hp1/global_enable] [get_bd_pins hier_pspl_port_hp2/global_enable]
connect_bd_net [get_bd_pins hier_readies/interrupts] [get_bd_pins hier_ps/IRQ_F2P]
connect_bd_net [get_bd_pins hier_pspl_port_acp/ready] [get_bd_pins hier_readies/local_ready_acp]
connect_bd_net [get_bd_pins hier_pspl_port_gp0/ready] [get_bd_pins hier_readies/local_ready_gp0]
connect_bd_net [get_bd_pins hier_pspl_port_hp0/ready] [get_bd_pins hier_readies/local_ready_hp0]
connect_bd_net [get_bd_pins hier_pspl_port_hp1/ready] [get_bd_pins hier_readies/local_ready_hp1]
connect_bd_net [get_bd_pins hier_pspl_port_hp2/ready] [get_bd_pins hier_readies/local_ready_hp2]
connect_bd_net -net local_enable_1 [get_bd_pins hier_enables/local_enable_hp2] [get_bd_pins hier_pspl_port_hp2/local_enable]
connect_bd_net [get_bd_pins hier_ps/aclk] \
  [get_bd_pins hier_pspl_port_acp/aclk] [get_bd_pins hier_pspl_port_gp0/aclk] [get_bd_pins hier_pspl_port_hp0/aclk] \
  [get_bd_pins hier_pspl_port_hp2/aclk] [get_bd_pins hier_pspl_port_hp1/aclk]
connect_bd_net [get_bd_pins hier_ps/peripheral_aresetn] \
  [get_bd_pins hier_pspl_port_hp2/peripheral_aresetn] [get_bd_pins hier_pspl_port_hp1/peripheral_aresetn] \
  [get_bd_pins hier_pspl_port_hp0/peripheral_aresetn] [get_bd_pins hier_pspl_port_acp/peripheral_aresetn] \
  [get_bd_pins hier_pspl_port_gp0/peripheral_aresetn]
connect_bd_net [get_bd_pins hier_ps/interconnect_aresetn] \
  [get_bd_pins hier_pspl_port_acp/interconnect_aresetn] [get_bd_pins hier_pspl_port_gp0/interconnect_aresetn] \
  [get_bd_pins hier_pspl_port_hp0/interconnect_aresetn] [get_bd_pins hier_pspl_port_hp2/interconnect_aresetn] \
  [get_bd_pins hier_pspl_port_hp1/interconnect_aresetn]

# ---- address map ----
assign_bd_address -offset 0x43C00000 -range 64K -target_address_space [get_bd_addr_spaces hier_ps/processing_system7_0/Data] [get_bd_addr_segs hier_pspl_port_acp/hier_hardware_accelerator_0/hardware_accelerator_0/s_axi_lite_registers/s_axi_lite_registers_reg]
assign_bd_address -offset 0x43C10000 -range 64K -target_address_space [get_bd_addr_spaces hier_ps/processing_system7_0/Data] [get_bd_addr_segs hier_pspl_port_acp/hier_hardware_accelerator_0/axi3_metrics_counter_0/s_axi_lite/s_axi_lite_reg]
assign_bd_address -offset 0x43C20000 -range 64K -target_address_space [get_bd_addr_spaces hier_ps/processing_system7_0/Data] [get_bd_addr_segs hier_pspl_port_hp0/hier_hardware_accelerator_0/hardware_accelerator_0/s_axi_lite_registers/s_axi_lite_registers_reg]
assign_bd_address -offset 0x43C30000 -range 64K -target_address_space [get_bd_addr_spaces hier_ps/processing_system7_0/Data] [get_bd_addr_segs hier_pspl_port_hp0/hier_hardware_accelerator_0/axi3_metrics_counter_0/s_axi_lite/s_axi_lite_reg]
assign_bd_address -offset 0x43C40000 -range 64K -target_address_space [get_bd_addr_spaces hier_ps/processing_system7_0/Data] [get_bd_addr_segs hier_pspl_port_gp0/hier_hardware_accelerator_0/hardware_accelerator_0/s_axi_lite_registers/s_axi_lite_registers_reg]
assign_bd_address -offset 0x43C50000 -range 64K -target_address_space [get_bd_addr_spaces hier_ps/processing_system7_0/Data] [get_bd_addr_segs hier_pspl_port_gp0/hier_hardware_accelerator_0/axi3_metrics_counter_0/s_axi_lite/s_axi_lite_reg]
assign_bd_address -offset 0x43C60000 -range 64K -target_address_space [get_bd_addr_spaces hier_ps/processing_system7_0/Data] [get_bd_addr_segs hier_pspl_port_hp1/hier_hardware_accelerator_0/hardware_accelerator_0/s_axi_lite_registers/s_axi_lite_registers_reg]
assign_bd_address -offset 0x43C70000 -range 64K -target_address_space [get_bd_addr_spaces hier_ps/processing_system7_0/Data] [get_bd_addr_segs hier_pspl_port_hp1/hier_hardware_accelerator_0/axi3_metrics_counter_0/s_axi_lite/s_axi_lite_reg]
assign_bd_address -offset 0x43C80000 -range 64K -target_address_space [get_bd_addr_spaces hier_ps/processing_system7_0/Data] [get_bd_addr_segs hier_pspl_port_hp2/hier_hardware_accelerator_0/hardware_accelerator_0/s_axi_lite_registers/s_axi_lite_registers_reg]
assign_bd_address -offset 0x43C90000 -range 64K -target_address_space [get_bd_addr_spaces hier_ps/processing_system7_0/Data] [get_bd_addr_segs hier_pspl_port_hp2/hier_hardware_accelerator_0/axi3_metrics_counter_0/s_axi_lite/s_axi_lite_reg]
assign_bd_address -offset 0x43CA0000 -range 64K -target_address_space [get_bd_addr_spaces hier_ps/processing_system7_0/Data] [get_bd_addr_segs hier_pspl_port_acp/hier_hardware_accelerator_1/hardware_accelerator_0/s_axi_lite_registers/s_axi_lite_registers_reg]
assign_bd_address -offset 0x43CB0000 -range 64K -target_address_space [get_bd_addr_spaces hier_ps/processing_system7_0/Data] [get_bd_addr_segs hier_pspl_port_acp/hier_hardware_accelerator_1/axi3_metrics_counter_0/s_axi_lite/s_axi_lite_reg]
assign_bd_address -offset 0x00000000 -range 512M -target_address_space [get_bd_addr_spaces hier_pspl_port_acp/hier_hardware_accelerator_0/hardware_accelerator_0/m_axi_full_data] [get_bd_addr_segs hier_ps/processing_system7_0/S_AXI_ACP/ACP_DDR_LOWOCM]
assign_bd_address -offset 0x40000000 -range 1G -target_address_space [get_bd_addr_spaces hier_pspl_port_acp/hier_hardware_accelerator_0/hardware_accelerator_0/m_axi_full_data] [get_bd_addr_segs hier_ps/processing_system7_0/S_AXI_ACP/ACP_M_AXI_GP0]
assign_bd_address -offset 0xE0000000 -range 4M -target_address_space [get_bd_addr_spaces hier_pspl_port_acp/hier_hardware_accelerator_0/hardware_accelerator_0/m_axi_full_data] [get_bd_addr_segs hier_ps/processing_system7_0/S_AXI_ACP/ACP_IOP]
assign_bd_address -offset 0xFC000000 -range 16M -target_address_space [get_bd_addr_spaces hier_pspl_port_acp/hier_hardware_accelerator_0/hardware_accelerator_0/m_axi_full_data] [get_bd_addr_segs hier_ps/processing_system7_0/S_AXI_ACP/ACP_QSPI_LINEAR]
assign_bd_address -offset 0xFFFC0000 -range 256K -target_address_space [get_bd_addr_spaces hier_pspl_port_acp/hier_hardware_accelerator_0/hardware_accelerator_0/m_axi_full_data] [get_bd_addr_segs hier_ps/processing_system7_0/S_AXI_ACP/ACP_HIGH_OCM]
assign_bd_address -offset 0x00000000 -range 512M -target_address_space [get_bd_addr_spaces hier_pspl_port_acp/hier_hardware_accelerator_1/hardware_accelerator_0/m_axi_full_data] [get_bd_addr_segs hier_ps/processing_system7_0/S_AXI_ACP/ACP_DDR_LOWOCM]
assign_bd_address -offset 0x40000000 -range 1G -target_address_space [get_bd_addr_spaces hier_pspl_port_acp/hier_hardware_accelerator_1/hardware_accelerator_0/m_axi_full_data] [get_bd_addr_segs hier_ps/processing_system7_0/S_AXI_ACP/ACP_M_AXI_GP0]
assign_bd_address -offset 0xE0000000 -range 4M -target_address_space [get_bd_addr_spaces hier_pspl_port_acp/hier_hardware_accelerator_1/hardware_accelerator_0/m_axi_full_data] [get_bd_addr_segs hier_ps/processing_system7_0/S_AXI_ACP/ACP_IOP]
assign_bd_address -offset 0xFC000000 -range 16M -target_address_space [get_bd_addr_spaces hier_pspl_port_acp/hier_hardware_accelerator_1/hardware_accelerator_0/m_axi_full_data] [get_bd_addr_segs hier_ps/processing_system7_0/S_AXI_ACP/ACP_QSPI_LINEAR]
assign_bd_address -offset 0xFFFC0000 -range 256K -target_address_space [get_bd_addr_spaces hier_pspl_port_acp/hier_hardware_accelerator_1/hardware_accelerator_0/m_axi_full_data] [get_bd_addr_segs hier_ps/processing_system7_0/S_AXI_ACP/ACP_HIGH_OCM]
assign_bd_address -offset 0x00000000 -range 512M -target_address_space [get_bd_addr_spaces hier_pspl_port_gp0/hier_hardware_accelerator_0/hardware_accelerator_0/m_axi_full_data] [get_bd_addr_segs hier_ps/processing_system7_0/S_AXI_GP0/GP0_DDR_LOWOCM]
assign_bd_address -offset 0x40000000 -range 1G -target_address_space [get_bd_addr_spaces hier_pspl_port_gp0/hier_hardware_accelerator_0/hardware_accelerator_0/m_axi_full_data] [get_bd_addr_segs hier_ps/processing_system7_0/S_AXI_GP0/GP0_M_AXI_GP0]
assign_bd_address -offset 0xE0000000 -range 4M -target_address_space [get_bd_addr_spaces hier_pspl_port_gp0/hier_hardware_accelerator_0/hardware_accelerator_0/m_axi_full_data] [get_bd_addr_segs hier_ps/processing_system7_0/S_AXI_GP0/GP0_IOP]
assign_bd_address -offset 0xFC000000 -range 16M -target_address_space [get_bd_addr_spaces hier_pspl_port_gp0/hier_hardware_accelerator_0/hardware_accelerator_0/m_axi_full_data] [get_bd_addr_segs hier_ps/processing_system7_0/S_AXI_GP0/GP0_QSPI_LINEAR]
assign_bd_address -offset 0xFFFC0000 -range 256K -target_address_space [get_bd_addr_spaces hier_pspl_port_gp0/hier_hardware_accelerator_0/hardware_accelerator_0/m_axi_full_data] [get_bd_addr_segs hier_ps/processing_system7_0/S_AXI_GP0/GP0_HIGH_OCM]
assign_bd_address -offset 0x00000000 -range 512M -target_address_space [get_bd_addr_spaces hier_pspl_port_hp0/hier_hardware_accelerator_0/hardware_accelerator_0/m_axi_full_data] [get_bd_addr_segs hier_ps/processing_system7_0/S_AXI_HP0/HP0_DDR_LOWOCM]
assign_bd_address -offset 0xFFFC0000 -range 256K -target_address_space [get_bd_addr_spaces hier_pspl_port_hp0/hier_hardware_accelerator_0/hardware_accelerator_0/m_axi_full_data] [get_bd_addr_segs hier_ps/processing_system7_0/S_AXI_HP0/HP0_HIGH_OCM]
assign_bd_address -offset 0x00000000 -range 512M -target_address_space [get_bd_addr_spaces hier_pspl_port_hp1/hier_hardware_accelerator_0/hardware_accelerator_0/m_axi_full_data] [get_bd_addr_segs hier_ps/processing_system7_0/S_AXI_HP1/HP1_DDR_LOWOCM]
assign_bd_address -offset 0xFFFC0000 -range 256K -target_address_space [get_bd_addr_spaces hier_pspl_port_hp1/hier_hardware_accelerator_0/hardware_accelerator_0/m_axi_full_data] [get_bd_addr_segs hier_ps/processing_system7_0/S_AXI_HP1/HP1_HIGH_OCM]
assign_bd_address -offset 0x00000000 -range 512M -target_address_space [get_bd_addr_spaces hier_pspl_port_hp2/hier_hardware_accelerator_0/hardware_accelerator_0/m_axi_full_data] [get_bd_addr_segs hier_ps/processing_system7_0/S_AXI_HP2/HP2_DDR_LOWOCM]
assign_bd_address -offset 0xFFFC0000 -range 256K -target_address_space [get_bd_addr_spaces hier_pspl_port_hp2/hier_hardware_accelerator_0/hardware_accelerator_0/m_axi_full_data] [get_bd_addr_segs hier_ps/processing_system7_0/S_AXI_HP2/HP2_HIGH_OCM]
